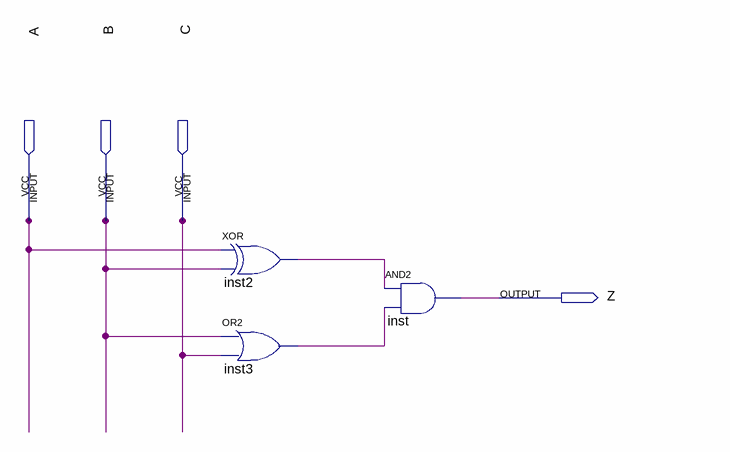
[diagram p0: schematic sheet]
// Quartus schematic DemoLogic.bdf as structural Verilog: 3 symbols, 4 pins
module DemoLogic (
  input  A,
  input  B,
  input  C,
  output Z
);

  wire inst2_out, inst3_out;

  xor inst2 (inst2_out, A, B);
  or inst3 (inst3_out, B, C);
  and inst (Z, inst2_out, inst3_out);
endmodule
